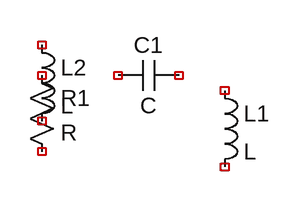
[diagram p0: schematic lab_1.asc]
lab_1.asc, the LTspice schematic file:
Version 4
SHEET 1 880 680
SYMBOL res 16 80 R0
SYMATTR InstName R1
SYMBOL cap 176 80 R90
WINDOW 0 0 32 VBottom 2
WINDOW 3 32 32 VTop 2
SYMATTR InstName C1
SYMBOL ind 208 96 R0
SYMATTR InstName L1
SYMBOL ind 16 48 R0
SYMATTR InstName L2

The netlist it stands for:
* lab_1.asc
R1 NC_01 NC_02 R
C1 NC_03 NC_04 C
L1 NC_05 NC_06 L
L2 NC_07 NC_08 L
.backanno
.end